# EAGLE design etch-fun (EAGLE 9.2.1)
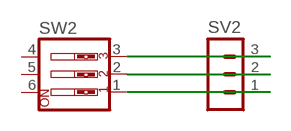
[diagram p0: schematic, sheet 1]

## Parts
SV2  MA03-1  [MA03-1]
SW2  SW_DIP-3  [EDG-03]

## Nets
N$1: SV2.1 SW2.1
N$2: SV2.2 SW2.2
N$3: SV2.3 SW2.3
Unconnected: SW2.4 SW2.5 SW2.6

## Library data of the parts
SV2 = con-lstb:MA03-1: PIN HEADER; OC_FARNELL: unknown; OC_NEWARK: unknown
SW2 = special:SW_DIP-3: DIP SWITCH

## Net classes
0 default: width 0.254 mm
1 test1: width 0.305 mm

## Board
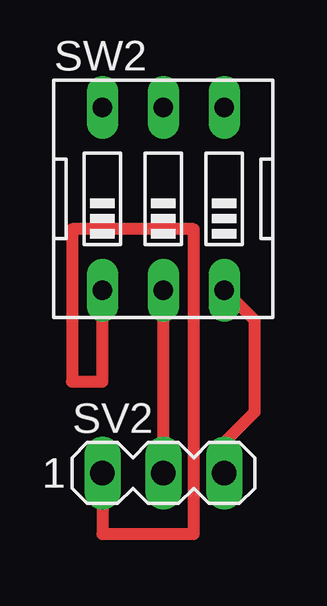
[diagram p1: board, top side]

No outline drawn. Coordinates in mm, seen from the top.
Copper layers (1*16): Top 0.035mm / dielectric 1.5mm / Bottom 0.035mm
Design rules "default": minimum track width 6mil, minimum drill 0.35mm, track to track 6mil, track to pad 6mil, pad to pad 6mil, via to via 6mil, smd to smd 6mil, copper to edge 40mil, drill to drill 6mil, minimum pad ring 10mil, minimum via ring 8mil, stop-mask expansion 4mil, vias tented up to drill 0mil, thermal gap 10mil

### Footprints (pad centres in the part's own frame; a part is rotated, then mirrored left to right if it is on the bottom)
MA03-1 = drill 1.016 long: 1 -2.54,0; 2 0,0; 3 2.54,0
EDG-03 = drill 0.813 long: 1 -2.54,-3.81; 2 0,-3.81; 3 2.54,-3.81; 4 2.54,3.81; 5 0,3.81; 6 -2.54,3.81

### Placement (x,y rotation side)
SV2  7.62,3.81 0 top
SW2  7.62,15.24 0 top

### Tracks (layer width: path | path; a pad name or v marks a point on that pad's centre or on a via)
N$1
  Top 0.508: SV2.1 5.08,1.27 8.89,1.27 8.89,13.97 3.81,13.97 3.81,7.62 5.08,7.62 SW2.1
N$2
  Top 0.508: SV2.2 SW2.2
N$3
  Top 0.508: SV2.3 10.16,5.08 11.43,6.35 11.43,8.89 | 11.43,8.89 11.43,10.16 SW2.3 | 11.43,8.89